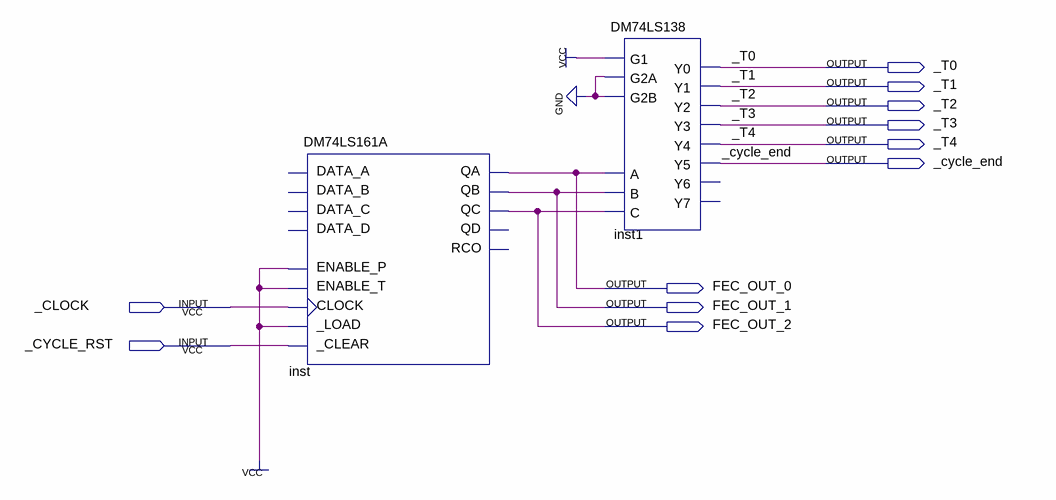
[diagram p0: schematic sheet]
// Quartus schematic FEC.bdf as structural Verilog: 2 symbols, 11 pins
module FEC (
  input  _CLOCK,
  input  _CYCLE_RST,
  output _T0,
  output _T1,
  output _T2,
  output _T3,
  output _T4,
  output _cycle_end,
  output FEC_OUT_0,
  output FEC_OUT_1,
  output FEC_OUT_2
);

  DM74LS161A inst (
    .CLOCK(_CLOCK), .ENABLE_P(1'b1), .ENABLE_T(1'b1), ._LOAD(1'b1), ._CLEAR(_CYCLE_RST), .QA(FEC_OUT_0),
    .QB(FEC_OUT_1), .QC(FEC_OUT_2));  // open: DATA_A, DATA_B, DATA_C, DATA_D, QD, RCO
  DM74LS138 inst1 (
    .G1(1'b1), .G2A(1'b0), .G2B(1'b0), .A(FEC_OUT_0), .B(FEC_OUT_1), .C(FEC_OUT_2), .Y0(_T0), .Y1(_T1),
    .Y2(_T2), .Y3(_T3), .Y4(_T4), .Y5(_cycle_end));  // open: Y6, Y7
endmodule
